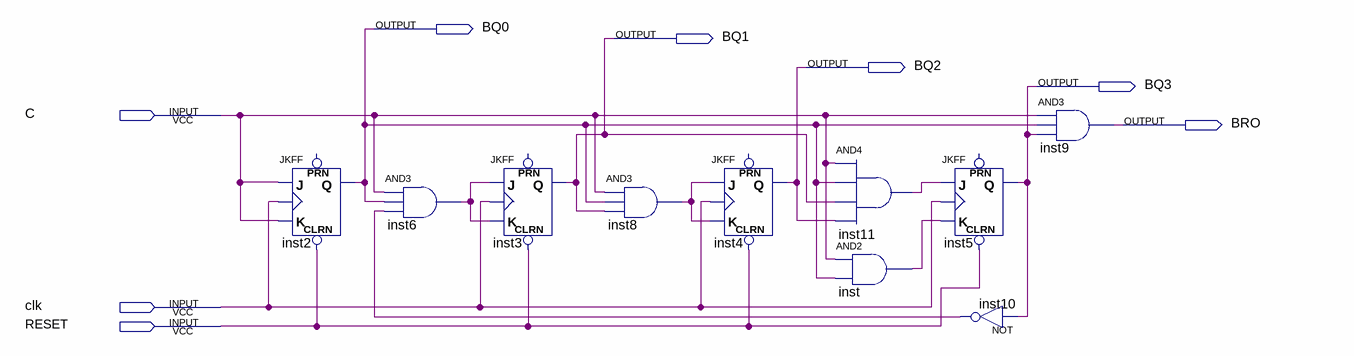
[diagram p0: schematic sheet]
// Quartus schematic BCD_counter.bdf as structural Verilog: 10 symbols, 8 pins
module BCD_counter (
  input  C,
  input  clk,
  input  RESET,
  output BQ0,
  output BQ1,
  output BQ2,
  output BQ3,
  output BRO
);

  wire inst6_out, inst8_out, inst10_out, inst11_out, inst_out;

  JKFF inst2 (.CLRN(RESET), .K(C), .J(C), .CLK(clk), .Q(BQ0));  // open: PRN
  and inst6 (inst6_out, C, BQ0, inst10_out);
  JKFF inst3 (.CLRN(RESET), .K(inst6_out), .J(inst6_out), .CLK(clk), .Q(BQ1));  // open: PRN
  and inst8 (inst8_out, C, BQ0, BQ1);
  JKFF inst4 (.CLRN(RESET), .K(inst8_out), .J(inst8_out), .CLK(clk), .Q(BQ2));  // open: PRN
  and inst11 (inst11_out, C, BQ0, BQ1, BQ2);
  and inst (inst_out, C, BQ0);
  JKFF inst5 (.CLRN(RESET), .K(inst_out), .J(inst11_out), .CLK(clk), .Q(BQ3));  // open: PRN
  not inst10 (inst10_out, BQ3);
  and inst9 (BRO, C, BQ0, BQ3);
endmodule
